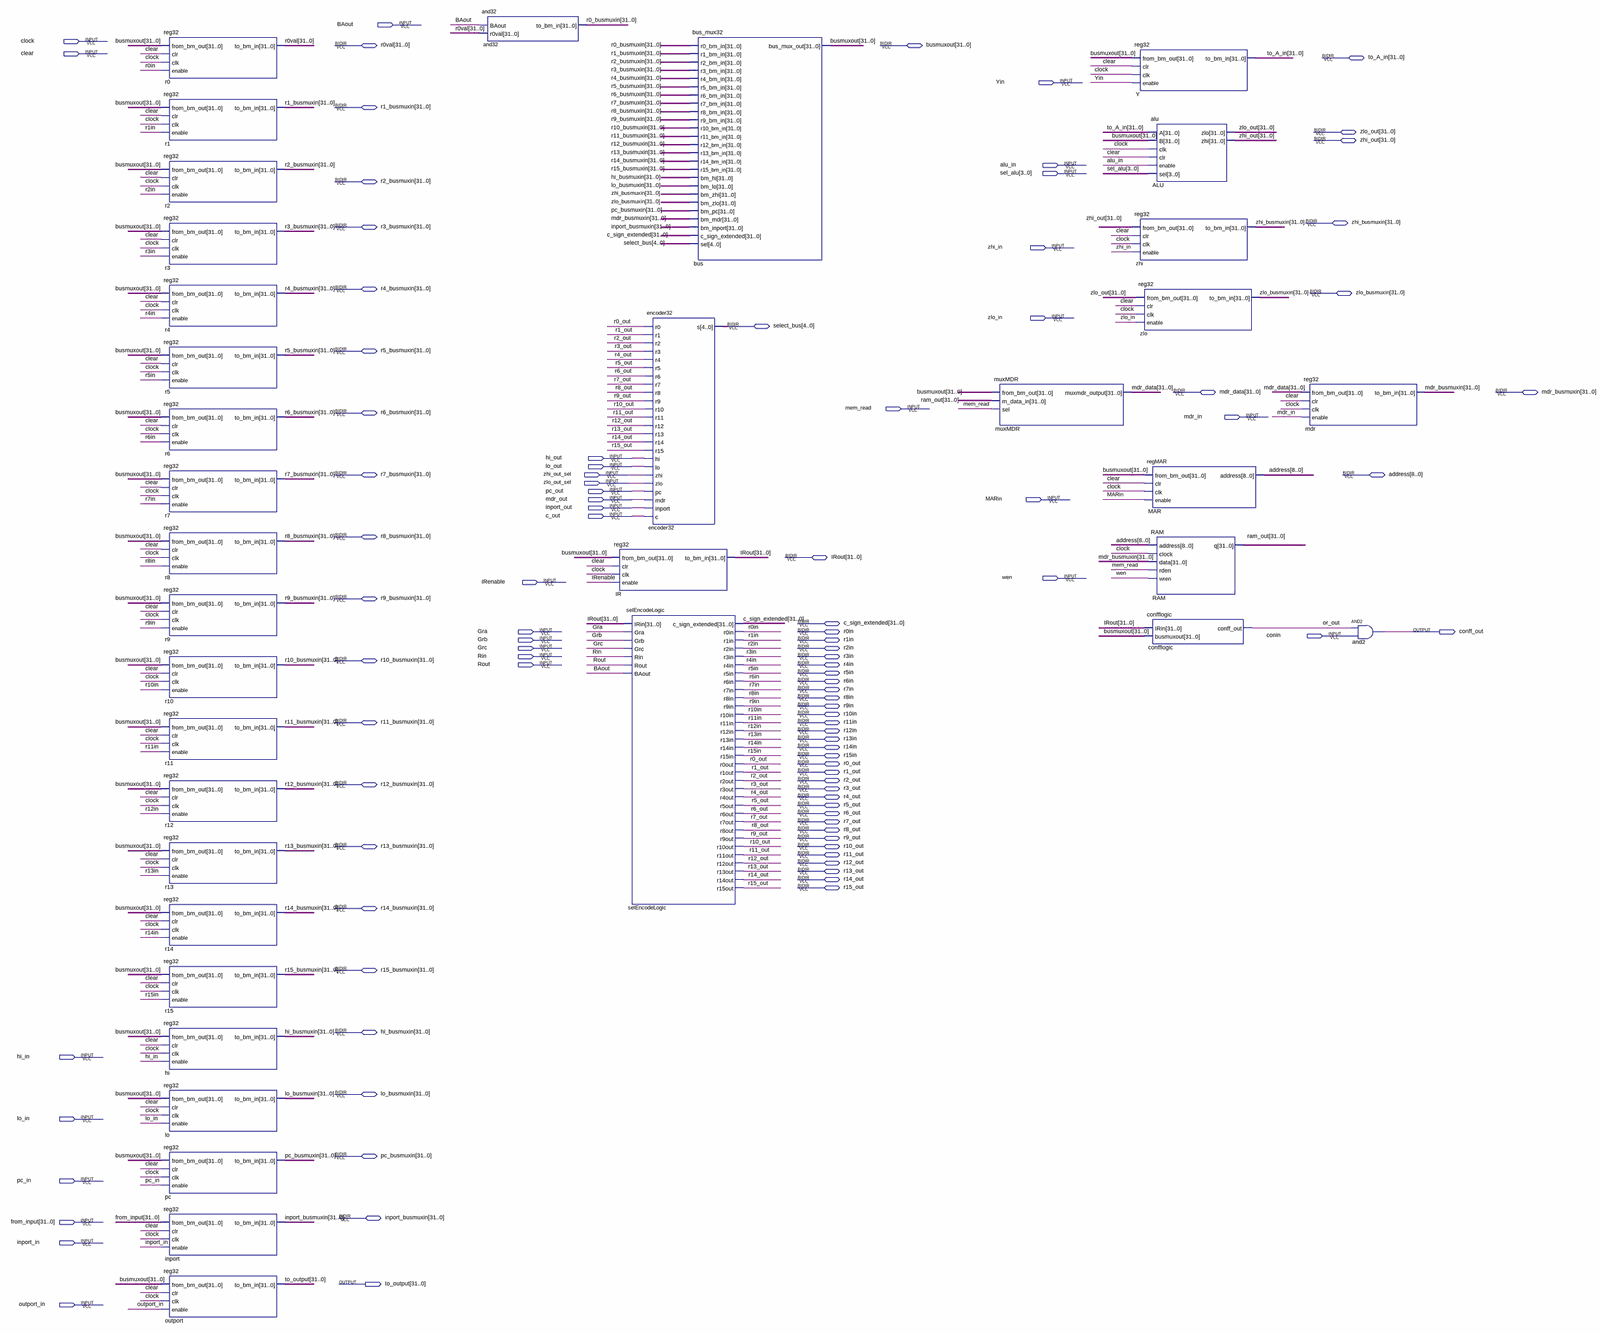
[diagram p0: schematic sheet, whole]
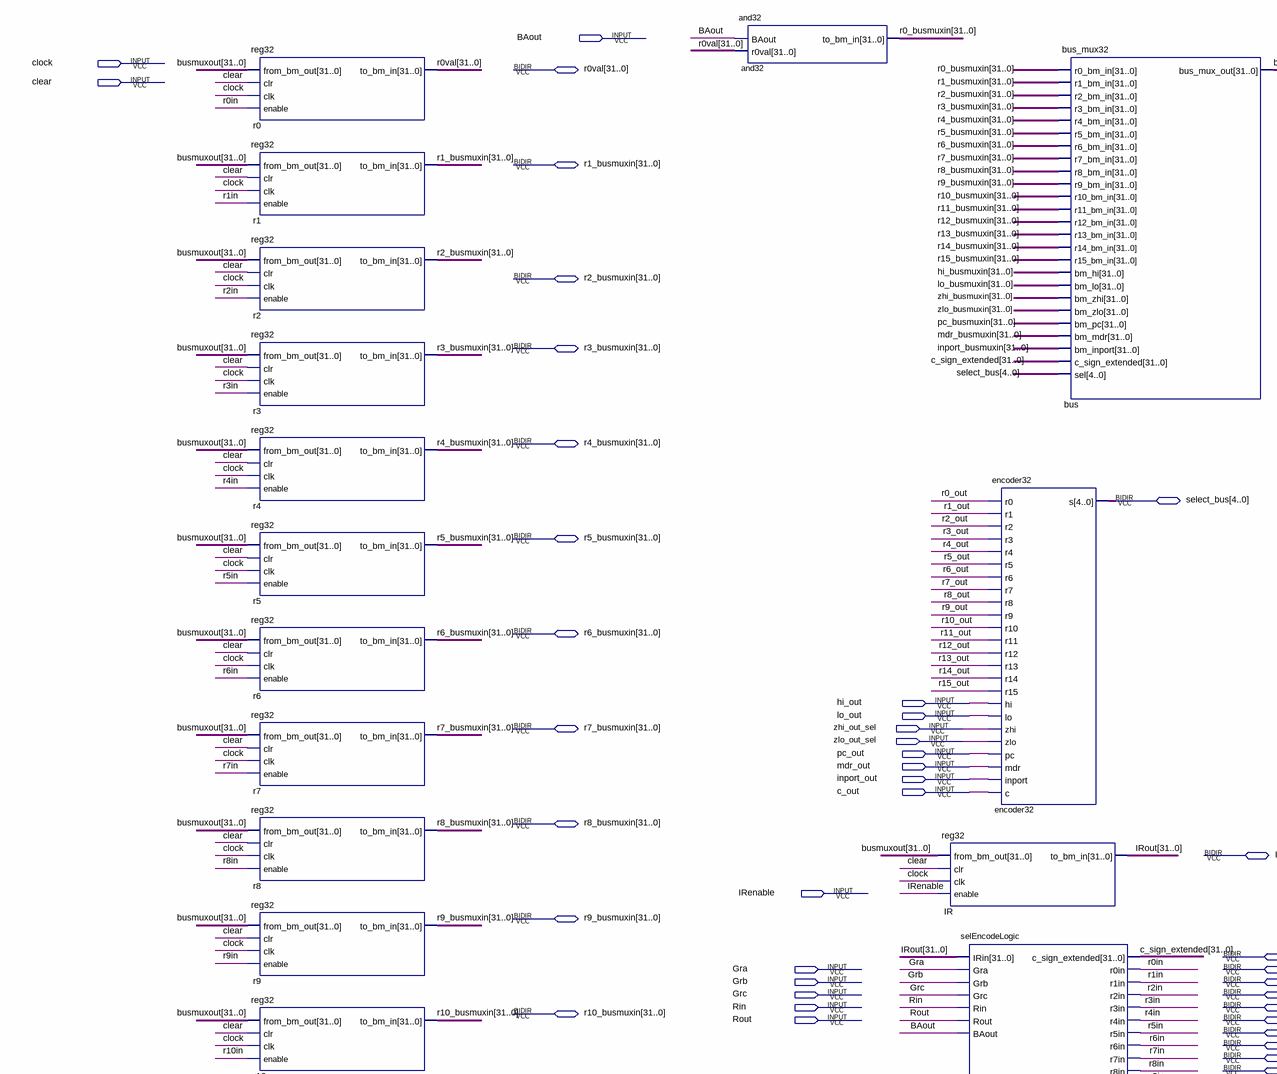
[diagram p1: schematic sheet, upper left part]
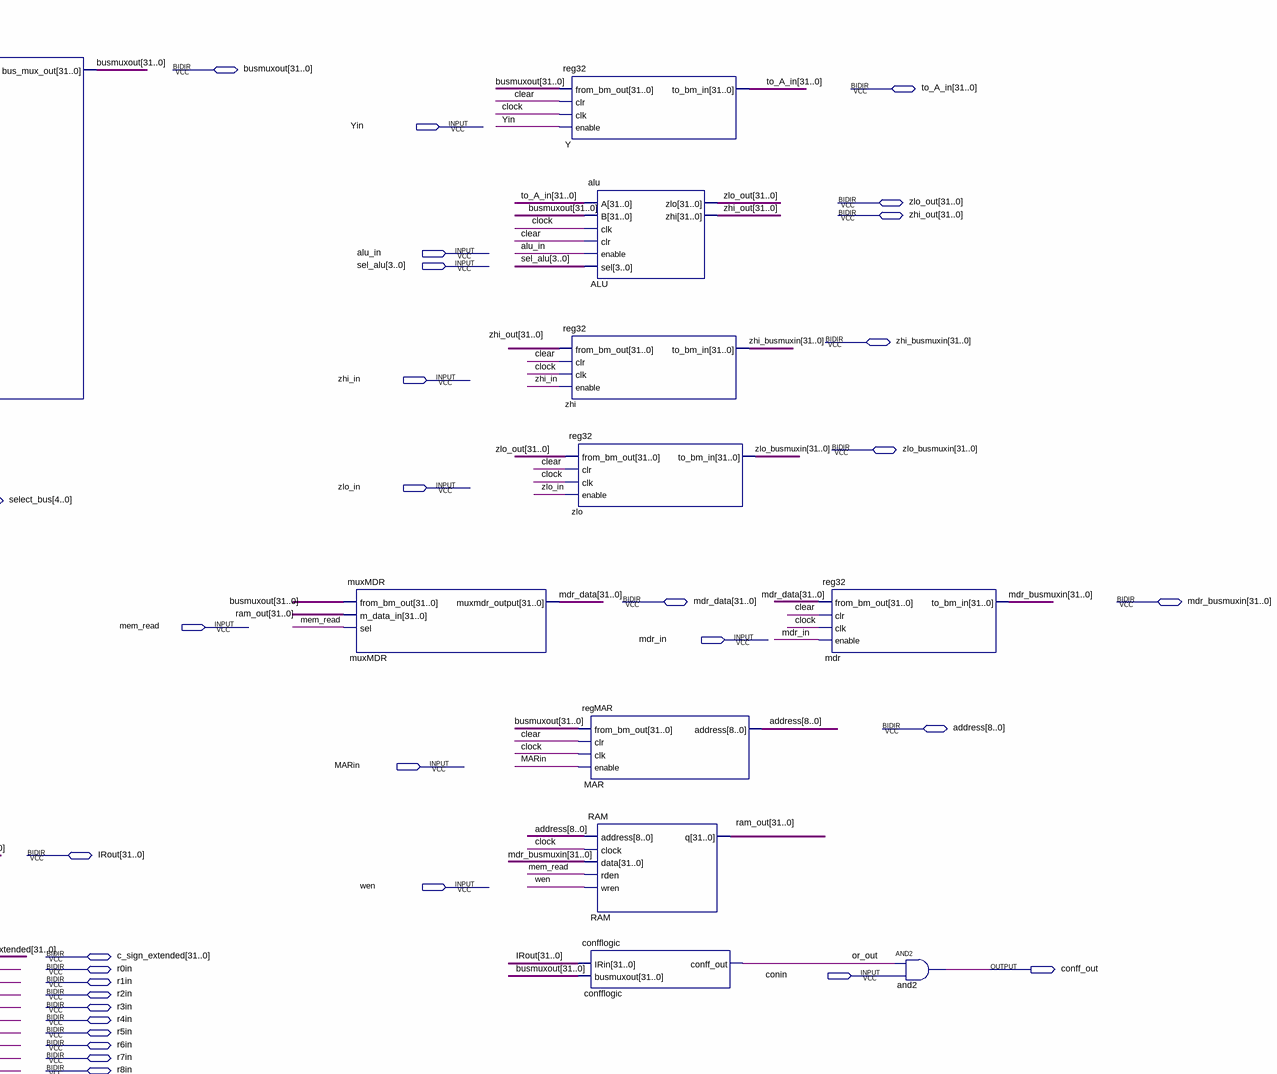
[diagram p2: schematic sheet, upper right part]
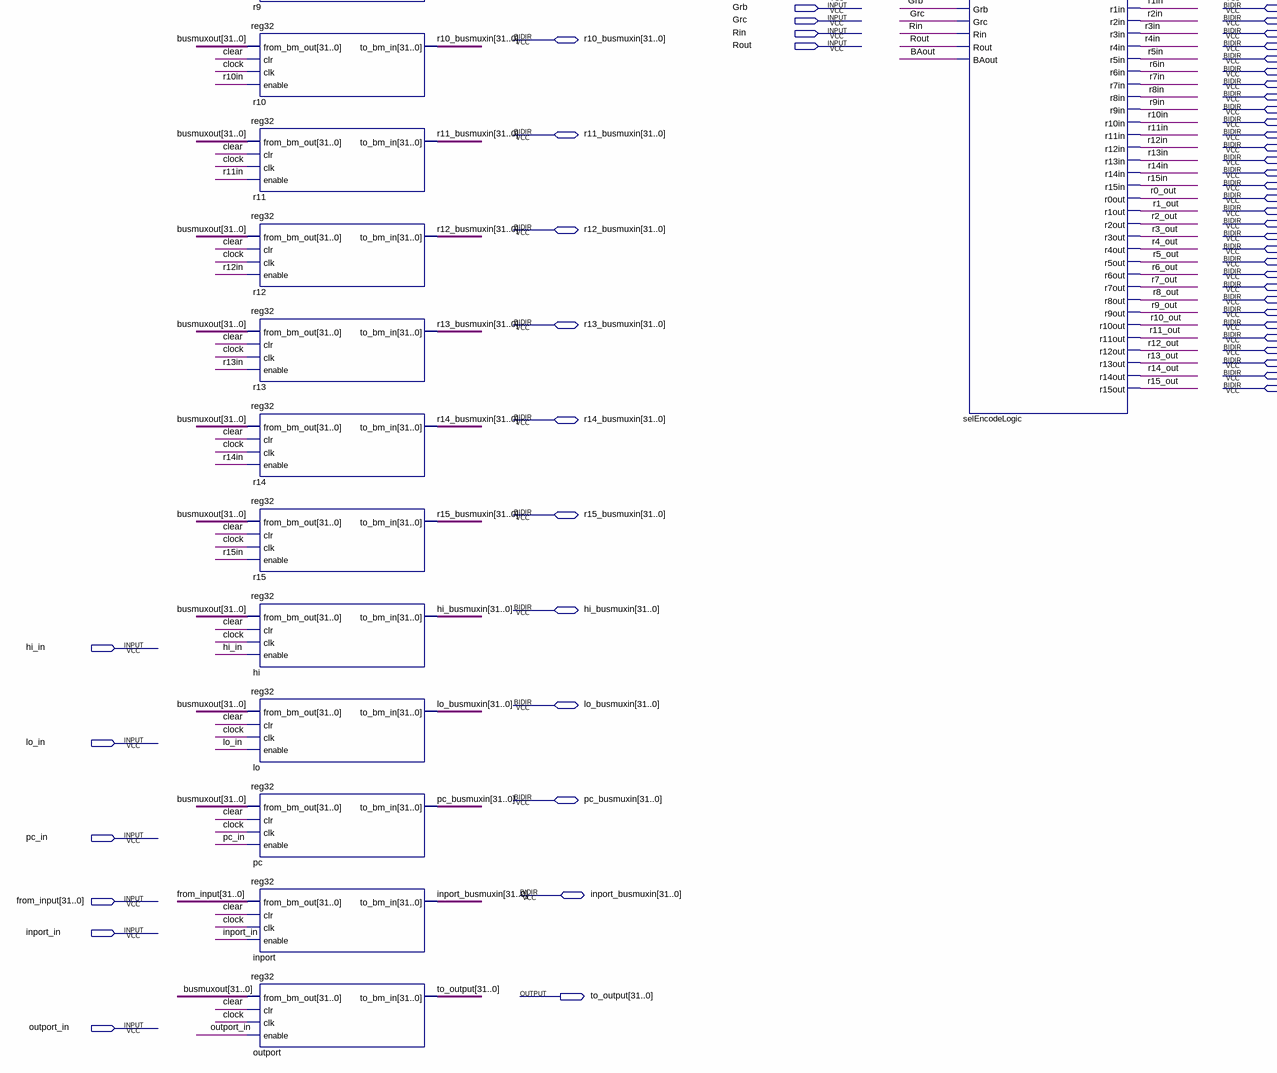
[diagram p3: schematic sheet, lower left part]
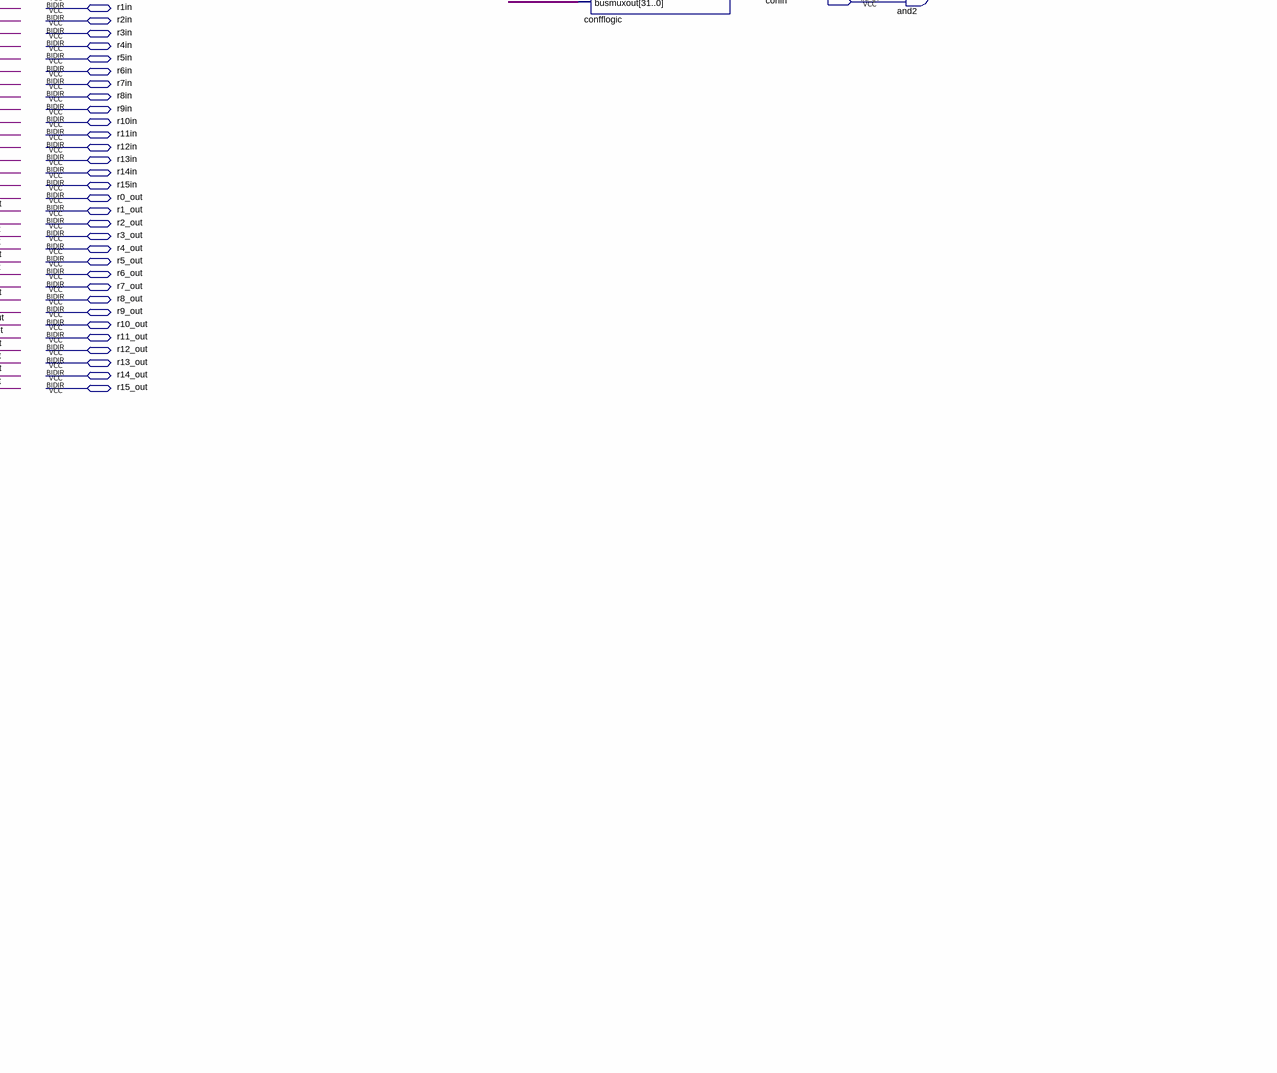
[diagram p4: schematic sheet, lower right part]
// Quartus schematic phase1.bdf as structural Verilog: 36 symbols, 99 pins
module phase1 (
  input  BAout,
  input  clock,
  input  clear,
  input  Yin,
  input  alu_in,
  input  [3:0] sel_alu,
  input  zhi_in,
  input  zlo_in,
  input  mem_read,
  input  mdr_in,
  input  hi_out,
  input  lo_out,
  input  zhi_out_sel,
  input  zlo_out_sel,
  input  pc_out,
  input  mdr_out,
  input  MARin,
  input  inport_out,
  input  c_out,
  input  wen,
  input  IRenable,
  input  Gra,
  input  conin,
  input  Grb,
  input  Grc,
  input  Rin,
  input  Rout,
  input  hi_in,
  input  lo_in,
  input  pc_in,
  input  [31:0] from_input,
  input  inport_in,
  input  outport_in,
  inout  [31:0] r0val,
  inout  [31:0] busmuxout,
  inout  [31:0] to_A_in,
  inout  [31:0] r1_busmuxin,
  inout  [31:0] zlo_out,
  inout  [31:0] zhi_out,
  inout  [31:0] r2_busmuxin,
  inout  [31:0] zhi_busmuxin,
  inout  [31:0] r3_busmuxin,
  inout  [31:0] r4_busmuxin,
  inout  [31:0] zlo_busmuxin,
  inout  [4:0] select_bus,
  inout  [31:0] r5_busmuxin,
  inout  [31:0] mdr_data,
  inout  [31:0] mdr_busmuxin,
  inout  [31:0] r6_busmuxin,
  inout  [31:0] r7_busmuxin,
  inout  [8:0] address,
  inout  [31:0] r8_busmuxin,
  inout  [31:0] IRout,
  inout  [31:0] r9_busmuxin,
  inout  [31:0] c_sign_extended,
  inout  r0in,
  inout  r1in,
  inout  r2in,
  inout  r3in,
  inout  [31:0] r10_busmuxin,
  inout  r4in,
  inout  r5in,
  inout  r6in,
  inout  r7in,
  inout  r8in,
  inout  r9in,
  inout  r10in,
  inout  [31:0] r11_busmuxin,
  inout  r11in,
  inout  r12in,
  inout  r13in,
  inout  r14in,
  inout  r15in,
  inout  r0_out,
  inout  r1_out,
  inout  r2_out,
  inout  [31:0] r12_busmuxin,
  inout  r3_out,
  inout  r4_out,
  inout  r5_out,
  inout  r6_out,
  inout  r7_out,
  inout  r8_out,
  inout  r9_out,
  inout  [31:0] r13_busmuxin,
  inout  r10_out,
  inout  r11_out,
  inout  r12_out,
  inout  r13_out,
  inout  r14_out,
  inout  r15_out,
  inout  [31:0] r14_busmuxin,
  inout  [31:0] r15_busmuxin,
  inout  [31:0] hi_busmuxin,
  inout  [31:0] lo_busmuxin,
  inout  [31:0] pc_busmuxin,
  inout  [31:0] inport_busmuxin,
  output conff_out,
  output [31:0] to_output
);

  wire or_out;
  wire [31:0] r0_busmuxin, ram_out;

  reg32 r0 (.from_bm_out(busmuxout), .clr(clear), .clk(clock), .enable(r0in), .to_bm_in(r0val));
  reg32 r1 (.from_bm_out(busmuxout), .clr(clear), .clk(clock), .enable(r1in), .to_bm_in(r1_busmuxin));
  reg32 r2 (.from_bm_out(busmuxout), .clr(clear), .clk(clock), .enable(r2in), .to_bm_in(r2_busmuxin));
  reg32 r3 (.from_bm_out(busmuxout), .clr(clear), .clk(clock), .enable(r3in), .to_bm_in(r3_busmuxin));
  reg32 r4 (.from_bm_out(busmuxout), .clr(clear), .clk(clock), .enable(r4in), .to_bm_in(r4_busmuxin));
  reg32 r5 (.from_bm_out(busmuxout), .clr(clear), .clk(clock), .enable(r5in), .to_bm_in(r5_busmuxin));
  reg32 r6 (.from_bm_out(busmuxout), .clr(clear), .clk(clock), .enable(r6in), .to_bm_in(r6_busmuxin));
  reg32 r7 (.from_bm_out(busmuxout), .clr(clear), .clk(clock), .enable(r7in), .to_bm_in(r7_busmuxin));
  reg32 r8 (.from_bm_out(busmuxout), .clr(clear), .clk(clock), .enable(r8in), .to_bm_in(r8_busmuxin));
  reg32 r9 (.from_bm_out(busmuxout), .clr(clear), .clk(clock), .enable(r9in), .to_bm_in(r9_busmuxin));
  reg32 r10 (.from_bm_out(busmuxout), .clr(clear), .clk(clock), .enable(r10in), .to_bm_in(r10_busmuxin));
  reg32 r11 (.from_bm_out(busmuxout), .clr(clear), .clk(clock), .enable(r11in), .to_bm_in(r11_busmuxin));
  reg32 r12 (.from_bm_out(busmuxout), .clr(clear), .clk(clock), .enable(r12in), .to_bm_in(r12_busmuxin));
  reg32 r13 (.from_bm_out(busmuxout), .clr(clear), .clk(clock), .enable(r13in), .to_bm_in(r13_busmuxin));
  reg32 r14 (.from_bm_out(busmuxout), .clr(clear), .clk(clock), .enable(r14in), .to_bm_in(r14_busmuxin));
  reg32 r15 (.from_bm_out(busmuxout), .clr(clear), .clk(clock), .enable(r15in), .to_bm_in(r15_busmuxin));
  reg32 hi (.from_bm_out(busmuxout), .clr(clear), .clk(clock), .enable(hi_in), .to_bm_in(hi_busmuxin));
  reg32 lo (.from_bm_out(busmuxout), .clr(clear), .clk(clock), .enable(lo_in), .to_bm_in(lo_busmuxin));
  reg32 pc (.from_bm_out(busmuxout), .clr(clear), .clk(clock), .enable(pc_in), .to_bm_in(pc_busmuxin));
  reg32 inport (.from_bm_out(from_input), .clr(clear), .clk(clock), .enable(inport_in), .to_bm_in(inport_busmuxin));
  reg32 outport (.from_bm_out(busmuxout), .clr(clear), .clk(clock), .enable(outport_in), .to_bm_in(to_output));
  and32 and32 (.BAout(BAout), .r0val(r0val), .to_bm_in(r0_busmuxin));
  reg32 IR (.from_bm_out(busmuxout), .clr(clear), .clk(clock), .enable(IRenable), .to_bm_in(IRout));
  encoder32 encoder32 (
    .r0(r0_out), .r1(r1_out), .r2(r2_out), .r3(r3_out), .r4(r4_out), .r5(r5_out), .r6(r6_out), .r7(r7_out),
    .r8(r8_out), .r9(r9_out), .r10(r10_out), .r11(r11_out), .r12(r12_out), .r13(r13_out), .r14(r14_out),
    .r15(r15_out), .hi(hi_out), .lo(lo_out), .zhi(zhi_out_sel), .zlo(zlo_out_sel), .pc(pc_out),
    .mdr(mdr_out), .inport(inport_out), .c(c_out), .s(select_bus));
  selEncodeLogic selEncodeLogic (
    .IRin(IRout), .Gra(Gra), .Grb(Grb), .Grc(Grc), .Rin(Rin), .Rout(Rout), .BAout(BAout),
    .c_sign_extended(c_sign_extended), .r0in(r0in), .r1in(r1in), .r2in(r2in), .r3in(r3in), .r4in(r4in),
    .r5in(r5in), .r6in(r6in), .r7in(r7in), .r8in(r8in), .r9in(r9in), .r10in(r10in), .r11in(r11in),
    .r12in(r12in), .r13in(r13in), .r14in(r14in), .r15in(r15in), .r0out(r0_out), .r1out(r1_out),
    .r2out(r2_out), .r3out(r3_out), .r4out(r4_out), .r5out(r5_out), .r6out(r6_out), .r7out(r7_out),
    .r8out(r8_out), .r9out(r9_out), .r10out(r10_out), .r11out(r11_out), .r12out(r12_out), .r13out(r13_out),
    .r14out(r14_out), .r15out(r15_out));
  bus_mux32 bus (
    .r0_bm_in(r0_busmuxin), .r1_bm_in(r1_busmuxin), .r2_bm_in(r2_busmuxin), .r3_bm_in(r3_busmuxin),
    .r4_bm_in(r4_busmuxin), .r5_bm_in(r5_busmuxin), .r6_bm_in(r6_busmuxin), .r7_bm_in(r7_busmuxin),
    .r8_bm_in(r8_busmuxin), .r9_bm_in(r9_busmuxin), .r10_bm_in(r10_busmuxin), .r11_bm_in(r11_busmuxin),
    .r12_bm_in(r12_busmuxin), .r13_bm_in(r13_busmuxin), .r14_bm_in(r14_busmuxin), .r15_bm_in(r15_busmuxin),
    .bm_hi(hi_busmuxin), .bm_lo(lo_busmuxin), .bm_zhi(zhi_busmuxin), .bm_zlo(zlo_busmuxin),
    .bm_pc(pc_busmuxin), .bm_mdr(mdr_busmuxin), .bm_inport(inport_busmuxin),
    .c_sign_extended(c_sign_extended), .sel(select_bus), .bus_mux_out(busmuxout));
  muxMDR muxMDR (.from_bm_out(busmuxout), .m_data_in(ram_out), .sel(mem_read), .muxmdr_output(mdr_data));
  reg32 Y (.from_bm_out(busmuxout), .clr(clear), .clk(clock), .enable(Yin), .to_bm_in(to_A_in));
  reg32 zhi (.from_bm_out(zhi_out), .clr(clear), .clk(clock), .enable(zhi_in), .to_bm_in(zhi_busmuxin));
  reg32 zlo (.from_bm_out(zlo_out), .clr(clear), .clk(clock), .enable(zlo_in), .to_bm_in(zlo_busmuxin));
  regMAR MAR (.from_bm_out(busmuxout), .clr(clear), .clk(clock), .enable(MARin), .address(address));
  confflogic confflogic (.IRin(IRout), .busmuxout(busmuxout), .conff_out(or_out));
  alu ALU (
    .A(to_A_in), .B(busmuxout), .clk(clock), .clr(clear), .enable(alu_in), .sel(sel_alu), .zlo(zlo_out),
    .zhi(zhi_out));
  RAM RAM (.address(address), .clock(clock), .data(mdr_busmuxin), .rden(mem_read), .wren(wen), .q(ram_out));
  reg32 mdr (.from_bm_out(mdr_data), .clr(clear), .clk(clock), .enable(mdr_in), .to_bm_in(mdr_busmuxin));
  and and2 (conff_out, or_out, conin);
endmodule
